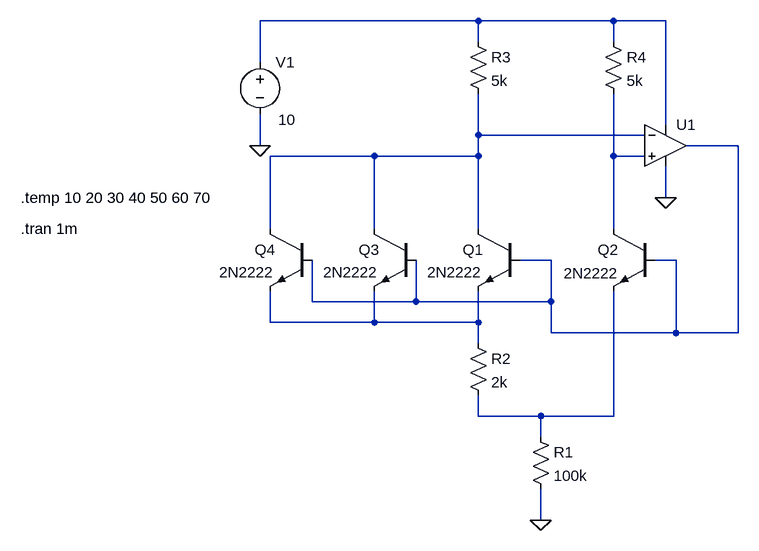
[diagram p0: schematic BrokawCell.asc]
BrokawCell.asc, the LTspice schematic file:
Version 4
SHEET 1 1596 708
WIRE 816 -80 480 -80
WIRE 1024 -80 816 -80
WIRE 1104 -80 1024 -80
WIRE 816 -48 816 -80
WIRE 1024 -48 1024 -80
WIRE 480 -16 480 -80
WIRE 1104 80 1104 -80
WIRE 816 96 816 32
WIRE 1072 96 816 96
WIRE 480 112 480 64
WIRE 1216 112 1136 112
WIRE 656 128 496 128
WIRE 816 128 816 96
WIRE 816 128 656 128
WIRE 1024 128 1024 32
WIRE 1072 128 1024 128
WIRE 1104 192 1104 144
WIRE 496 240 496 128
WIRE 656 240 656 128
WIRE 816 240 816 128
WIRE 1024 240 1024 128
WIRE 928 288 880 288
WIRE 1120 288 1088 288
WIRE 560 352 560 288
WIRE 720 352 720 288
WIRE 720 352 560 352
WIRE 928 352 928 288
WIRE 928 352 720 352
WIRE 496 384 496 336
WIRE 656 384 656 336
WIRE 656 384 496 384
WIRE 816 384 816 336
WIRE 816 384 656 384
WIRE 928 400 928 352
WIRE 1120 400 1120 288
WIRE 1120 400 928 400
WIRE 1216 400 1216 112
WIRE 1216 400 1120 400
WIRE 816 416 816 384
WIRE 816 528 816 496
WIRE 912 528 816 528
WIRE 1024 528 1024 336
WIRE 1024 528 912 528
WIRE 912 560 912 528
WIRE 912 688 912 640
FLAG 912 688 0
FLAG 480 112 0
FLAG 1104 192 0
SYMBOL npn 880 240 M0
WINDOW 3 58 67 Left 2
SYMATTR Value 2N2222
SYMATTR InstName Q1
SYMBOL npn 1088 240 M0
SYMATTR InstName Q2
SYMATTR Value 2N2222
SYMBOL res 800 400 R0
SYMATTR InstName R2
SYMATTR Value 2k
SYMBOL res 896 544 R0
SYMATTR InstName R1
SYMATTR Value 100k
SYMBOL res 800 -64 R0
SYMATTR InstName R3
SYMATTR Value 5k
SYMBOL res 1008 -64 R0
SYMATTR InstName R4
SYMATTR Value 5k
SYMBOL voltage 480 -32 R0
WINDOW 3 28 104 Left 2
WINDOW 123 0 0 Left 2
WINDOW 39 0 0 Left 2
SYMATTR Value 10
SYMATTR InstName V1
SYMBOL Opamps\\UniversalOpamp2 1104 112 R0
SYMATTR InstName U1
SYMATTR Value2 Avol=10Meg GBW=10Meg Slew=10Meg
SYMBOL npn 720 240 M0
WINDOW 3 58 67 Left 2
SYMATTR Value 2N2222
SYMATTR InstName Q3
SYMBOL npn 560 240 M0
WINDOW 3 58 67 Left 2
SYMATTR Value 2N2222
SYMATTR InstName Q4
TEXT 112 192 Left 2 !.temp 10 20 30 40 50 60 70
TEXT 112 240 Left 2 !.tran 1m

The netlist it stands for:
* BrokawCell.asc
Q1 N002 N003 N005 0 2N2222
Q2 N004 N003 N006 0 2N2222
R2 N005 N006 2k
R1 N006 0 100k
R3 N001 N002 5k
R4 N001 N004 5k
V1 N001 0 10
XU1 N004 N002 N001 0 N003 level.2 Avol=10Meg GBW=10Meg Slew=10Meg ilimit=25m rail=0 Vos=0 phimargin=45 en=0 enk=0 in=0 ink=0 Rin=500Meg  ; pins IN+ IN- V+ V- OUT
Q3 N002 N003 N005 0 2N2222
Q4 N002 N003 N005 0 2N2222
.model NPN NPN
.model PNP PNP
.lib standard.bjt
.temp 10 20 30 40 50 60 70
.tran 1m
.lib UniversalOpamps2.sub
.backanno
.end